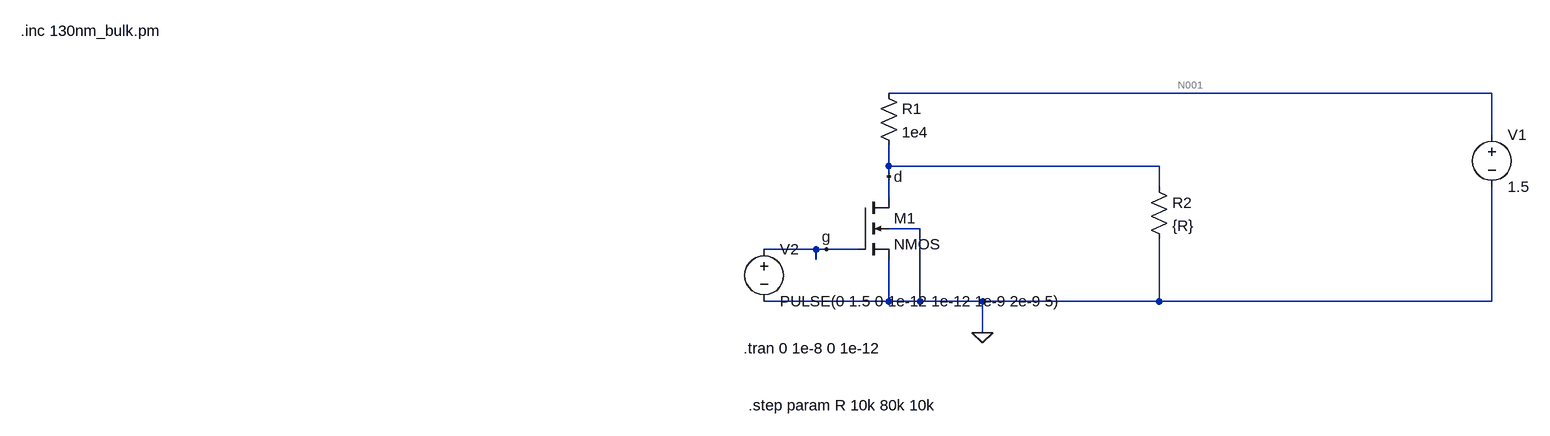
[diagram p0: schematic pulse_char.asc]
pulse_char.asc, the LTspice schematic file:
Version 4
SHEET 1 1184 680
WIRE 1120 -16 192 -16
WIRE 1120 48 1120 -16
WIRE 192 96 192 64
WIRE 608 96 192 96
WIRE 192 112 192 96
WIRE 608 128 608 96
WIRE 192 144 192 112
WIRE 240 192 192 192
WIRE 80 224 0 224
WIRE 96 224 80 224
WIRE 144 224 96 224
WIRE 80 240 80 224
WIRE 192 304 192 240
WIRE 192 304 0 304
WIRE 240 304 240 192
WIRE 240 304 192 304
WIRE 336 304 240 304
WIRE 608 304 608 208
WIRE 608 304 336 304
WIRE 1120 304 1120 128
WIRE 1120 304 608 304
WIRE 336 352 336 304
FLAG 336 352 0
FLAG 192 112 d
FLAG 96 224 g
SYMBOL res 176 -32 R0
SYMATTR InstName R1
SYMATTR Value 1e4
SYMBOL voltage 1120 32 R0
WINDOW 123 0 0 Left 0
WINDOW 39 0 0 Left 0
SYMATTR InstName V1
SYMATTR Value 1.5
SYMBOL voltage 0 208 R0
WINDOW 123 0 0 Left 0
WINDOW 39 0 0 Left 0
SYMATTR InstName V2
SYMATTR Value PULSE(0 1.5 0 1e-12 1e-12 1e-9 2e-9 5)
SYMBOL nmos4 144 144 R0
SYMATTR InstName M1
SYMATTR Value2 l=130e-9 w=260e-9 ad=676000e-18 as=676000e-18 pd=3640e-9 ps=3640e-9
SYMBOL res 592 112 R0
SYMATTR InstName R2
SYMATTR Value {R}
TEXT -32 376 Left 2 !.tran 0 1e-8 0 1e-12
TEXT -1144 -112 Left 2 !.inc 130nm_bulk.pm
TEXT -24 464 Left 2 !.step param R 10k 80k 10k

The netlist it stands for:
* pulse_char.asc
R1 N001 d 1e4
V1 N001 0 1.5
V2 g 0 PULSE(0 1.5 0 1e-12 1e-12 1e-9 2e-9 5)
M1 d g 0 0 NMOS l=130e-9 w=260e-9 ad=676000e-18 as=676000e-18 pd=3640e-9 ps=3640e-9
R2 d 0 {R}
.model NMOS NMOS
.model PMOS PMOS
.lib standard.mos
.tran 0 1e-8 0 1e-12
.inc 130nm_bulk.pm
.step param R 10k 80k 10k
.backanno
.end

* Results of the author's LTspice run, read from the files saved beside the schematic
* Operating Point (first step), zero values left out:
*   r = 10 k
*   V(n001) = 1.5 V
*   V(d) = 750 mV
*   Id(M1) = 2.281 nA
*   Ig(M1) = -8.654 pA
*   Is(M1) = -2.271 nA
*   I(R2) = 75 µA
*   I(R1) = 75 µA
*   I(V2) = 8.654 pA
*   I(V1) = -75 µA
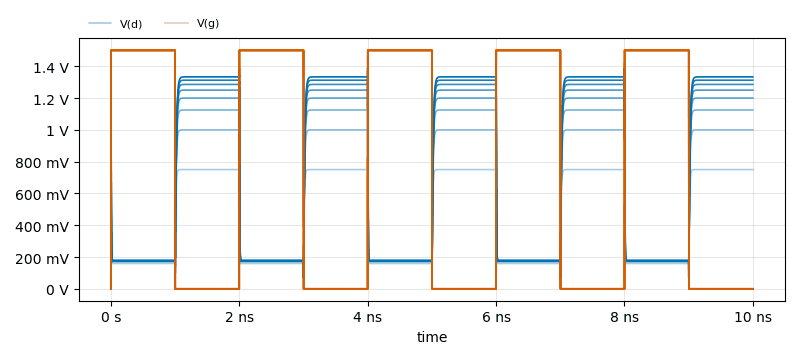
[diagram p1: Transient Analysis of pulse_char.asc, plotted from the saved traces]
* Transient Analysis, 8 runs:
*   V(d) [r=10000]: min 55.97 mV, max 822.8 mV, average 451.8 mV, rms 538.9 mV, last 750 mV
*   V(d) [r=20000]: min 66.65 mV, max 1.067 V, average 580 mV, rms 711.4 mV, last 1 V
*   V(d) [r=30000]: min 70.61 mV, max 1.189 V, average 643.2 mV, rms 797.6 mV, last 1.125 V
*   V(d) [r=40000]: min 72.68 mV, max 1.262 V, average 680.9 mV, rms 849.3 mV, last 1.2 V
*   V(d) [r=50000]: min 73.96 mV, max 1.31 V, average 705.9 mV, rms 883.7 mV, last 1.25 V
*   V(d) [r=60000]: min 74.82 mV, max 1.345 V, average 723.8 mV, rms 908.3 mV, last 1.286 V
*   V(d) [r=70000]: min 75.44 mV, max 1.371 V, average 737.2 mV, rms 926.7 mV, last 1.312 V
*   V(d) [r=80000]: min 75.91 mV, max 1.391 V, average 747.5 mV, rms 941.1 mV, last 1.333 V
*   V(g) [r=10000]: min 0 V, max 1.5 V, average 750.7 mV, rms 1.061 V, last 0 V
*   V(g) [r=20000]: min 0 V, max 1.5 V, average 750.7 mV, rms 1.061 V, last 0 V
*   V(g) [r=30000]: min 0 V, max 1.5 V, average 750.7 mV, rms 1.061 V, last 0 V
*   V(g) [r=40000]: min 0 V, max 1.5 V, average 750.7 mV, rms 1.061 V, last 0 V
*   V(g) [r=50000]: min 0 V, max 1.5 V, average 750.7 mV, rms 1.061 V, last 0 V
*   V(g) [r=60000]: min 0 V, max 1.5 V, average 750.7 mV, rms 1.061 V, last 0 V
*   V(g) [r=70000]: min 0 V, max 1.5 V, average 750.7 mV, rms 1.061 V, last 0 V
*   V(g) [r=80000]: min 0 V, max 1.5 V, average 750.7 mV, rms 1.061 V, last 0 V